# Altium schematic sheet BLOCKS.SchDoc
size A; SheetNumber: 1; SheetTotal: 5
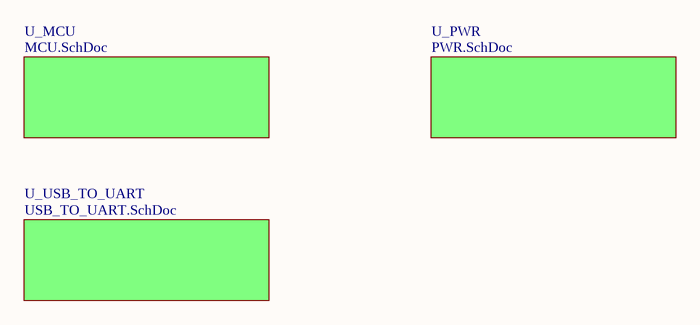
[diagram p0: BLOCKS.SchDoc]

## Sub-sheets
U_MCU = MCU.SchDoc: no entries
U_PWR = PWR.SchDoc: no entries
U_USB_TO_UART = USB_TO_UART.SchDoc: no entries